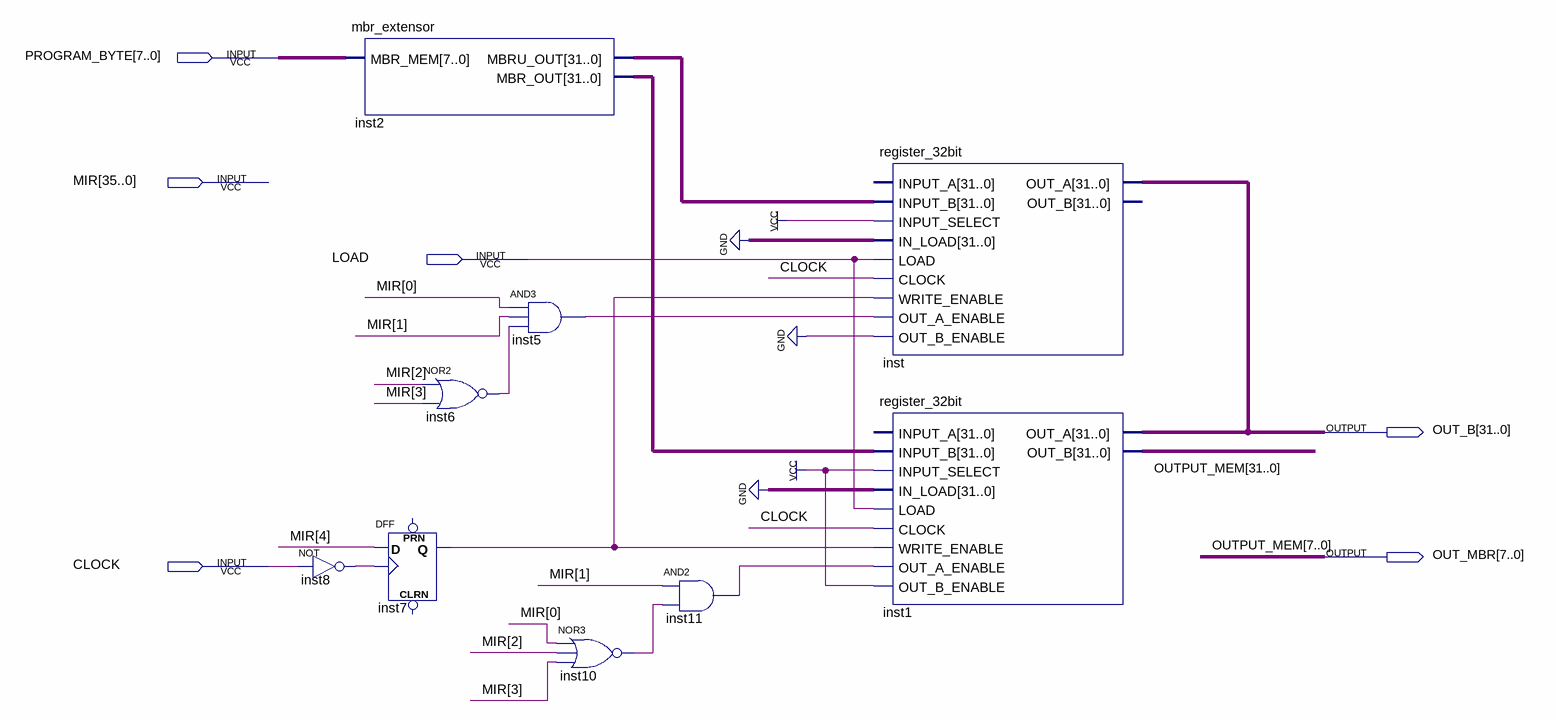
[diagram p0: schematic sheet]
// Quartus schematic MBR.bdf as structural Verilog: 9 symbols, 6 pins
module MBR (
  input  [7:0] PROGRAM_BYTE,
  input  [35:0] MIR,
  input  LOAD,
  input  CLOCK,
  output [31:0] OUT_B,
  output [7:0] OUT_MBR
);

  wire inst5_out, inst6_out, inst7_q, inst8_out, inst10_out, inst11_out;
  wire [31:0] inst2_mbr_out, inst2_mbru_out;
  wire [31:8] OUTPUT_MEM;

  not inst8 (inst8_out, CLOCK);
  mbr_extensor inst2 (.MBR_MEM(PROGRAM_BYTE), .MBRU_OUT(inst2_mbru_out), .MBR_OUT(inst2_mbr_out));
  DFF inst7 (.CLK(inst8_out), .D(MIR[4]), .Q(inst7_q));  // open: CLRN, PRN
  nor inst6 (inst6_out, MIR[2], MIR[3]);
  and inst5 (inst5_out, MIR[0], MIR[1], inst6_out);
  nor inst10 (inst10_out, MIR[0], MIR[2], MIR[3]);
  and inst11 (inst11_out, MIR[1], inst10_out);
  register_32bit inst (
    .INPUT_B(inst2_mbru_out), .INPUT_SELECT(1'b1), .IN_LOAD({32{1'b0}}), .LOAD(LOAD), .CLOCK(CLOCK),
    .WRITE_ENABLE(inst7_q), .OUT_A_ENABLE(inst5_out), .OUT_B_ENABLE(1'b0), .OUT_A(OUT_B));  // open: INPUT_A, OUT_B
  register_32bit inst1 (
    .INPUT_B(inst2_mbr_out), .INPUT_SELECT(1'b1), .IN_LOAD({32{1'b0}}), .LOAD(LOAD), .CLOCK(CLOCK),
    .WRITE_ENABLE(inst7_q), .OUT_A_ENABLE(inst11_out), .OUT_B_ENABLE(1'b1), .OUT_A(OUT_B),
    .OUT_B({OUTPUT_MEM, OUT_MBR}));  // open: INPUT_A

  // Other names for the same wires on the sheet: OUTPUT_MEM[7:0] = OUT_MBR
endmodule
